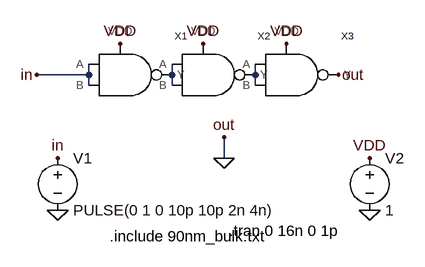
[diagram p0: schematic test-not3.asc]
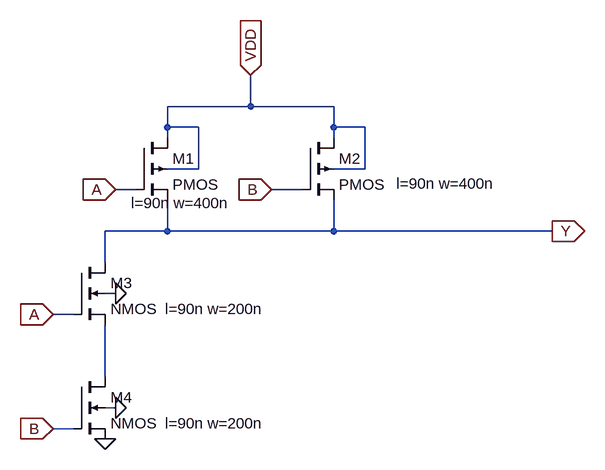
[diagram p1: sub-circuit nand.asc]
test-not3.asc, the LTspice schematic file:
Version 4
SHEET 1 880 680
WIRE 48 144 48 128
WIRE 48 144 -32 144
WIRE 176 144 176 128
WIRE 304 144 304 128
WIRE 48 160 48 144
WIRE 176 160 176 144
WIRE 304 160 304 144
WIRE 256 272 256 240
FLAG 432 144 out
FLAG -32 144 in
FLAG 0 272 in
FLAG 0 352 0
FLAG 480 272 VDD
FLAG 480 352 0
FLAG 96 96 VDD
FLAG 224 96 VDD
FLAG 352 96 VDD
FLAG 256 272 0
FLAG 256 240 out
SYMBOL nand 96 144 R0
SYMATTR InstName X1
SYMBOL nand 224 144 R0
SYMATTR InstName X2
SYMBOL nand 352 144 R0
SYMATTR InstName X3
SYMBOL voltage 0 256 R0
WINDOW 123 0 0 Left 0
WINDOW 39 0 0 Left 0
SYMATTR InstName V1
SYMATTR Value PULSE(0 1 0 10p 10p 2n 4n)
SYMBOL voltage 480 256 R0
WINDOW 123 0 0 Left 0
WINDOW 39 0 0 Left 0
SYMATTR InstName V2
SYMATTR Value 1
TEXT 80 392 Left 2 !.include 90nm_bulk.txt
TEXT 264 384 Left 2 !.tran 0 16n 0 1p

nand.asc, the sub-circuit schematic file:
Version 4
SHEET 1 1436 680
WIRE 896 -896 896 -944
WIRE 896 -896 768 -896
WIRE 1024 -896 896 -896
WIRE 768 -864 768 -896
WIRE 816 -864 768 -864
WIRE 1024 -864 1024 -896
WIRE 1072 -864 1024 -864
WIRE 768 -848 768 -864
WIRE 1024 -848 1024 -864
WIRE 816 -800 816 -864
WIRE 816 -800 768 -800
WIRE 1072 -800 1072 -864
WIRE 1072 -800 1024 -800
WIRE 720 -768 688 -768
WIRE 976 -768 928 -768
WIRE 768 -704 768 -752
WIRE 768 -704 672 -704
WIRE 1024 -704 1024 -752
WIRE 1024 -704 768 -704
WIRE 1360 -704 1024 -704
WIRE 672 -656 672 -704
WIRE 688 -608 672 -608
WIRE 624 -576 592 -576
WIRE 672 -480 672 -560
WIRE 688 -432 672 -432
WIRE 624 -400 592 -400
FLAG 688 -768 A
IOPIN 688 -768 In
FLAG 592 -576 A
IOPIN 592 -576 In
FLAG 1360 -704 Y
IOPIN 1360 -704 Out
FLAG 896 -944 VDD
IOPIN 896 -944 In
FLAG 928 -768 B
IOPIN 928 -768 In
FLAG 592 -400 B
IOPIN 592 -400 In
FLAG 688 -608 0
FLAG 688 -432 0
FLAG 672 -384 0
SYMBOL pmos4 720 -848 R0
WINDOW 123 -8 101 Left 2
SYMATTR InstName M1
SYMATTR Value2 l=90n w=400n
SYMBOL pmos4 976 -848 R0
WINDOW 123 144 71 Left 2
SYMATTR InstName M2
SYMATTR Value2 l=90n w=400n
SYMBOL nmos4 624 -656 R0
WINDOW 123 140 72 Left 2
SYMATTR InstName M3
SYMATTR Value2 l=90n w=200n
SYMBOL nmos4 624 -480 R0
WINDOW 123 140 72 Left 2
SYMATTR InstName M4
SYMATTR Value2 l=90n w=200n

The netlist it stands for:
* test-not3.asc
XX1 in in VDD N001 nand
XX2 N001 N001 VDD N002 nand
XX3 N002 N002 VDD 0 nand
V1 in 0 PULSE(0 1 0 10p 10p 2n 4n)
V2 VDD 0 1

* block symbol definitions
.subckt nand A B VDD Y
M1 VDD A Y VDD PMOS l=90n w=400n
M2 VDD B Y VDD PMOS l=90n w=400n
M3 Y A N001 0 NMOS l=90n w=200n
M4 N001 B 0 0 NMOS l=90n w=200n
.ends nand

.model NMOS NMOS
.model PMOS PMOS
.lib standard.mos
.include 90nm_bulk.txt
.tran 0 16n 0 1p
.backanno
.end